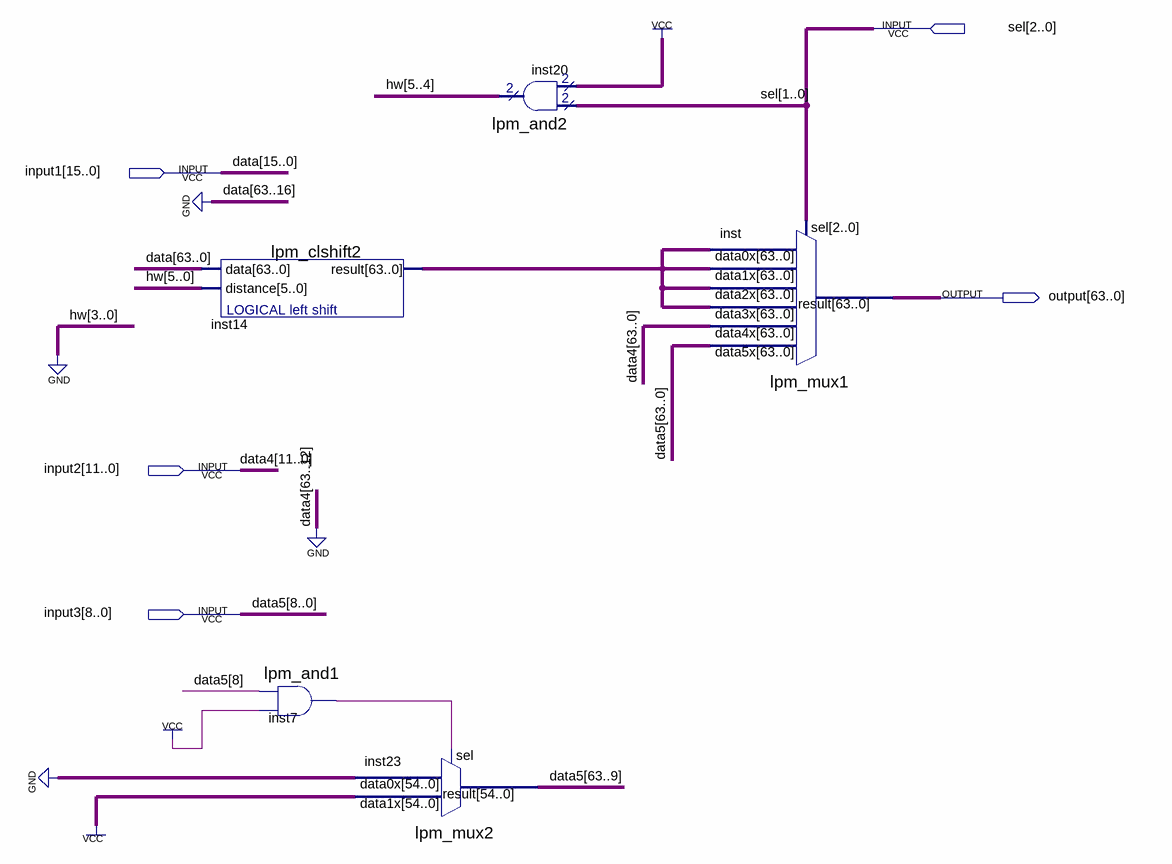
[diagram p0: schematic sheet]
// Quartus schematic ExtU.bdf as structural Verilog: 5 symbols, 5 pins
module ExtU (
  input  [2:0] sel,
  input  [15:0] input1,
  input  [11:0] input2,
  input  [8:0] input3,
  output [63:0] \output 
);

  wire inst7_result;
  wire [5:4] hw;
  wire [63:0] inst14_result;
  wire [63:9] data5;

  lpm_clshift2 inst14 (.data({{48{1'b0}}, input1}), .distance({hw, 4'b0000}), .result(inst14_result));
  lpm_and1 inst7 (.data0(input3[8]), .data1(1'b1), .result(inst7_result));
  lpm_mux2 inst23 (.data1x({55{1'b1}}), .data0x({55{1'b0}}), .sel(inst7_result), .result(data5));
  lpm_and2 inst20 (.data0x(sel[1:0]), .data1x(2'b11), .result(hw));
  lpm_mux1 inst (
    .data5x({data5, input3}), .data4x({{52{1'b0}}, input2}), .data3x(inst14_result), .data2x(inst14_result),
    .data1x(inst14_result), .data0x(inst14_result), .sel(sel), .result(\output ));

  // Other names for the same wires on the sheet: data[15:0] = input1; data4[11:0] = input2; data5[8:0] = input3
endmodule
